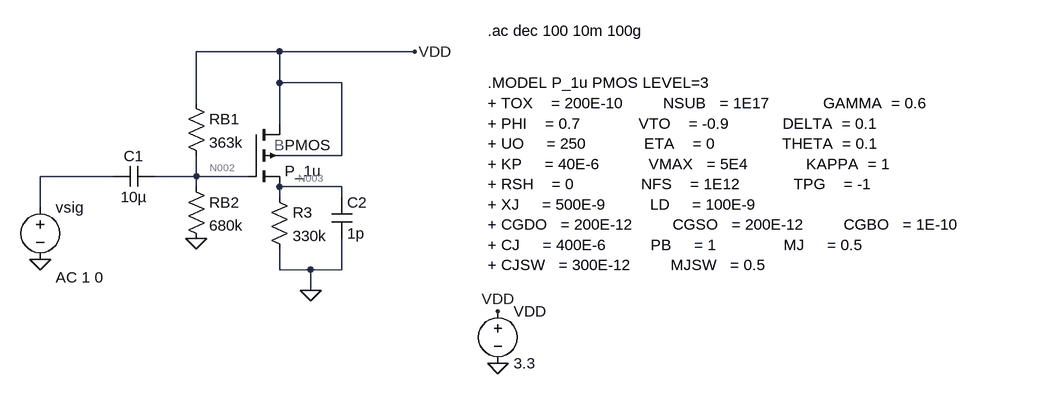
[diagram p0: schematic Simu_gain.asc]
Simu_gain.asc, the LTspice schematic file:
Version 4
SHEET 1 1588 680
WIRE 416 -96 288 -96
WIRE 624 -96 416 -96
WIRE 416 -48 416 -96
WIRE 512 -48 416 -48
WIRE 288 -16 288 -96
WIRE 416 16 416 -48
WIRE 512 64 512 -48
WIRE 512 64 416 64
WIRE 160 96 48 96
WIRE 288 96 288 64
WIRE 288 96 224 96
WIRE 368 96 288 96
WIRE 288 112 288 96
WIRE 512 112 416 112
WIRE 416 128 416 112
WIRE 512 128 512 112
WIRE 48 144 48 96
WIRE 416 240 416 208
WIRE 464 240 416 240
WIRE 512 240 512 192
WIRE 512 240 464 240
WIRE 464 272 464 240
FLAG 624 -96 VDD
FLAG 288 192 0
FLAG 48 224 0
FLAG 752 384 0
FLAG 752 304 VDD
FLAG 464 272 0
SYMBOL voltage 48 128 R0
WINDOW 123 24 124 Left 2
WINDOW 39 0 0 Left 0
SYMATTR Value2 AC 1 0
SYMATTR InstName vsig
SYMATTR Value ""
SYMBOL cap 224 80 R90
WINDOW 0 0 32 VBottom 2
WINDOW 3 32 32 VTop 2
SYMATTR InstName C1
SYMATTR Value 10µ
SYMBOL res 272 96 R0
SYMATTR InstName RB2
SYMATTR Value 680k
SYMBOL res 272 -32 R0
SYMATTR InstName RB1
SYMATTR Value 363k
SYMBOL res 400 112 R0
SYMATTR InstName R3
SYMATTR Value 330k
SYMBOL cap 496 128 R0
SYMATTR InstName C2
SYMATTR Value 1p
SYMBOL pmos4 368 16 R0
SYMATTR InstName PMOS
SYMATTR Value P_1u
SYMATTR Value2 l=1u w=2.5u
SYMBOL voltage 752 288 R0
WINDOW 123 0 0 Left 0
WINDOW 39 0 0 Left 0
SYMATTR InstName VDD
SYMATTR Value 3.3
TEXT 736 -48 Left 2 !.MODEL P_1u PMOS LEVEL=3\n+ TOX    = 200E-10         NSUB   = 1E17            GAMMA  = 0.6          \n+ PHI    = 0.7             VTO    = -0.9            DELTA  = 0.1          \n+ UO     = 250             ETA    = 0               THETA  = 0.1         \n+ KP     = 40E-6           VMAX   = 5E4             KAPPA  = 1         \n+ RSH    = 0               NFS    = 1E12            TPG    = -1                 \n+ XJ     = 500E-9          LD     = 100E-9               \n+ CGDO   = 200E-12         CGSO   = 200E-12         CGBO   = 1E-10              \n+ CJ     = 400E-6          PB     = 1               MJ     = 0.5                \n+ CJSW   = 300E-12         MJSW   = 0.5
TEXT 408 48 Left 2 ;B
TEXT 736 -128 Left 2 !.ac dec 100 10m 100g

The netlist it stands for:
* Simu_gain.asc
vsig N001 0 AC 1 0
C1 N002 N001 10µ
RB2 N002 0 680k
RB1 VDD N002 363k
R3 N003 0 330k
C2 N003 0 1p
M§PMOS VDD N002 N003 VDD P_1u l=1u w=2.5u
VDD VDD 0 3.3
.model NMOS NMOS
.model PMOS PMOS
.lib standard.mos
.MODEL P_1u PMOS LEVEL=3
+ TOX    = 200E-10         NSUB   = 1E17            GAMMA  = 0.6
+ PHI    = 0.7             VTO    = -0.9            DELTA  = 0.1
+ UO     = 250             ETA    = 0               THETA  = 0.1
+ KP     = 40E-6           VMAX   = 5E4             KAPPA  = 1
+ RSH    = 0               NFS    = 1E12            TPG    = -1
+ XJ     = 500E-9          LD     = 100E-9
+ CGDO   = 200E-12         CGSO   = 200E-12         CGBO   = 1E-10
+ CJ     = 400E-6          PB     = 1               MJ     = 0.5
+ CJSW   = 300E-12         MJSW   = 0.5
* B
.ac dec 100 10m 100g
.backanno
.end

* Results of the author's LTspice run, read from the files saved beside the schematic
* Operating Point, zero values left out:
*   V(n002) = 2.151 V
*   V(vdd) = 3.3 V
*   V(n003) = 1.586 V
*   Id(Pmos) = 4.805 µA
*   Ib(Pmos) = 1.724 pA
*   Is(Pmos) = -4.805 µA
*   I(R3) = 4.805 µA
*   I(Rb1) = 3.164 µA
*   I(Rb2) = 3.164 µA
*   I(Vdd) = -7.969 µA
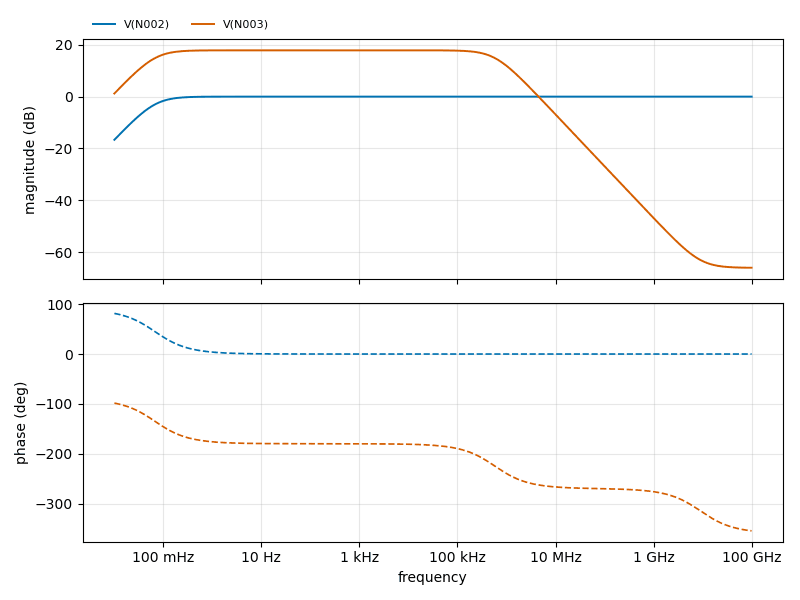
[diagram p1: AC Analysis of Simu_gain.asc, plotted from the saved traces]
* AC Analysis, 1 run:
*   V(N002): -16.65 dB at 10 mHz, -0.00 dB at 100 GHz, peak -0.00 dB at 1.585 GHz, 3 dB below the peak at 67.25 mHz
*   V(N003): 1.21 dB at 10 mHz, -65.99 dB at 100 GHz, peak 17.86 dB at 199.5 Hz, 3 dB below the peak at 67.25 mHz and 581.7 kHz